# Altium schematic sheet Power.SchDoc
size A4
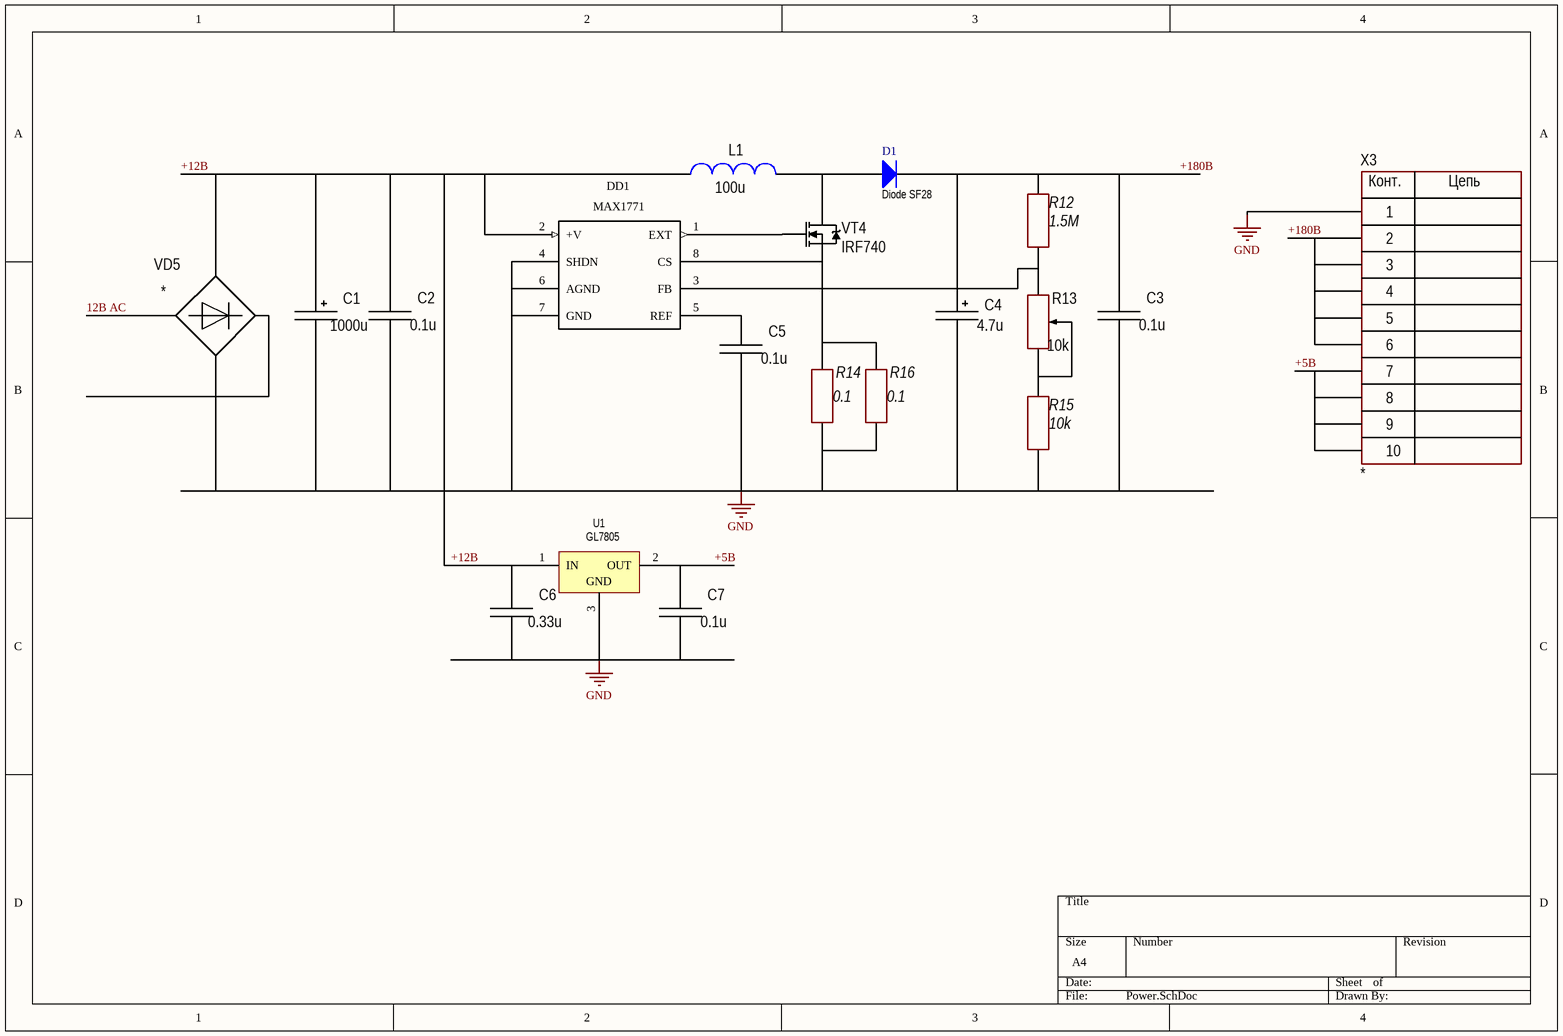
[diagram p0: Power.SchDoc]

## Parts
C1  1000u  [D5C2H11]
C2  0.1u  [CAP: DEBB33D]
C3  0.1u  [CAP: DEBB33D]
C4  4.7u  [D8C3.5H12]
C5  0.1u  [CAP: DEBB33D]
C6  0.33u  [CAP: DEBB33D]
C7  0.1u  [CAP: DEBB33D]
D1  Diode SF28  [DO-201AD]
DD1  MAX1771  [MAX1771_DIP8 - duplicate]
L1  100u  [IND: SRU1048]
R12  1.5M  [MLT]
R13  10k  [RES: 3296W]
R14  0.1  [MLT]
R15  10k  [MLT]
R16  0.1  [MLT]
U1  GL7805  [TO220VW]
VD5  *  [DIOD: DF206S-G]
VT4  IRF740  [TO220_123_H]
X3  *  [CON: S10B-PHD]

## Nets
GND: C1.2 C2.2 C3.2 C4.2 C5.2 C6.2 C7.2 DD1.4(SHDN) DD1.6(AGND) DD1.7(GND) R14.1 R15.2 R16.1 U1.3(GND) VD5.4 X3.1
12В AC: VD5.1
+5В: C7.1 U1.2(OUT) X3.7 X3.8 X3.9 X3.10
+12В: C1.1 C2.1 C6.1 DD1.2(+V) L1.2 U1.1(IN) VD5.2
+180В: C3.1 C4.1 D1.2(K) R12.1 X3.2 X3.3 X3.4 X3.5 X3.6
NetC5_1: C5.1 DD1.5(REF)
NetD1_1: D1.1(A) L1.1 VT4.2(D)
NetDD1_1: DD1.1(EXT) VT4.1(G)
NetDD1_3: DD1.3(FB) R12.2 R13.1
NetDD1_8: DD1.8(CS) R14.2 R16.2 VT4.3(S)
NetR13_2: R13.2 R13.3 R15.1

Not connected (* = marked no-connect by the designer): VD5 3

## Notes on the sheet
- (in symbol 10-Connector) Конт.; Цепь

## Library data of the parts
C1 C4 = AlumCap: Manufacturer: *; Model: *; HelpURL: *; ComponentKind: *; Value: *
C2 C3 C5-C7 = Capacitor: Manufacturer: *; Model: *; HelpURL: *; ComponentKind: *; Value: *
D1 = Diode 1N5402: 3 Amp General Purpose Rectifier; Published: 8-Jun-2000; LatestRevisionDate: 17-Jul-2002; LatestRevisionNote: Re-released for DXP Platform.; DatasheetVersion: 1998; PackageVersion: Aug-1999; PackageReference: DO-201AD; Publisher: Altium Limited; PackageDescription: Diode, Axial; Body 9.5 x 5.6 mm (LxDia. max), Lead Dia. 1.32 mm (max); ComponentLink1Description: Manufacturer Link; ComponentLink1URL: http://www.fairchildsemi.com/; ComponentLink2Description: Datasheet; ComponentLink2URL: http://www.fairchildsemi.com/ds/1N%2F1N5400.pdf
L1 = Inductor: Manufacturer: *; Model: *; HelpURL: *; ComponentKind: *; Value: *
R12 R14-R16 = Resistor: MLT; Model: *; Manufacture: *; HelpURL: *; Case: *; Value: *
R13 = ADJ resistor: Manufacturer: *; Model: *; HelpURL: *; ComponentKind: *; Value: *
U1 = L78S05CV: 2A Positive Voltage Regulator; Note: Tab is connected to pin 3 (GND).; Published: 24-Aug-2001; LatestRevisionDate: 17-Jul-2002; LatestRevisionNote: Re-released for DXP Platform.; DatasheetVersion: Jan-1993; PackageVersion: Apr-1998; PackageReference: TO220VW; Publisher: Altium Limited; PackageDescription: TO, Thru-Hole, Vertical, Heatsink Mounted; 3 In-Line Leads; Pitch 2.54 mm; Pin sequence 1, 3, 2; ComponentLink1Description: Manufacturer Link; ComponentLink1URL: http://www.st.com/; ComponentLink2Description: Datasheet; ComponentLink2URL: http://www.st.com/stonline/products/literature/ds/2148/l78s10c.pdf
VD5 = Bridge: ComponentKind: *; Manufacturer: *; Model: *; HelpURL: *
VT4 = N-chanel: Mosfet; Model: *; Manufacturer: *; ComponentKind: *; HelpURL: *
X3 = 10-Connector: Model: *; Manufacturer: *; HelpURL: *; ComponentKind: *